# Altium schematic sheet [12] - FTDI.SchDoc: FTDI
size A3; Organization: Bjørn T. Brodtkorb; Address1: Frode Rinnans veg 161; Address2: 7050 Trondheim; DocumentNumber: 6598; Revision: 1.0; SheetNumber: 1; SheetTotal: 1
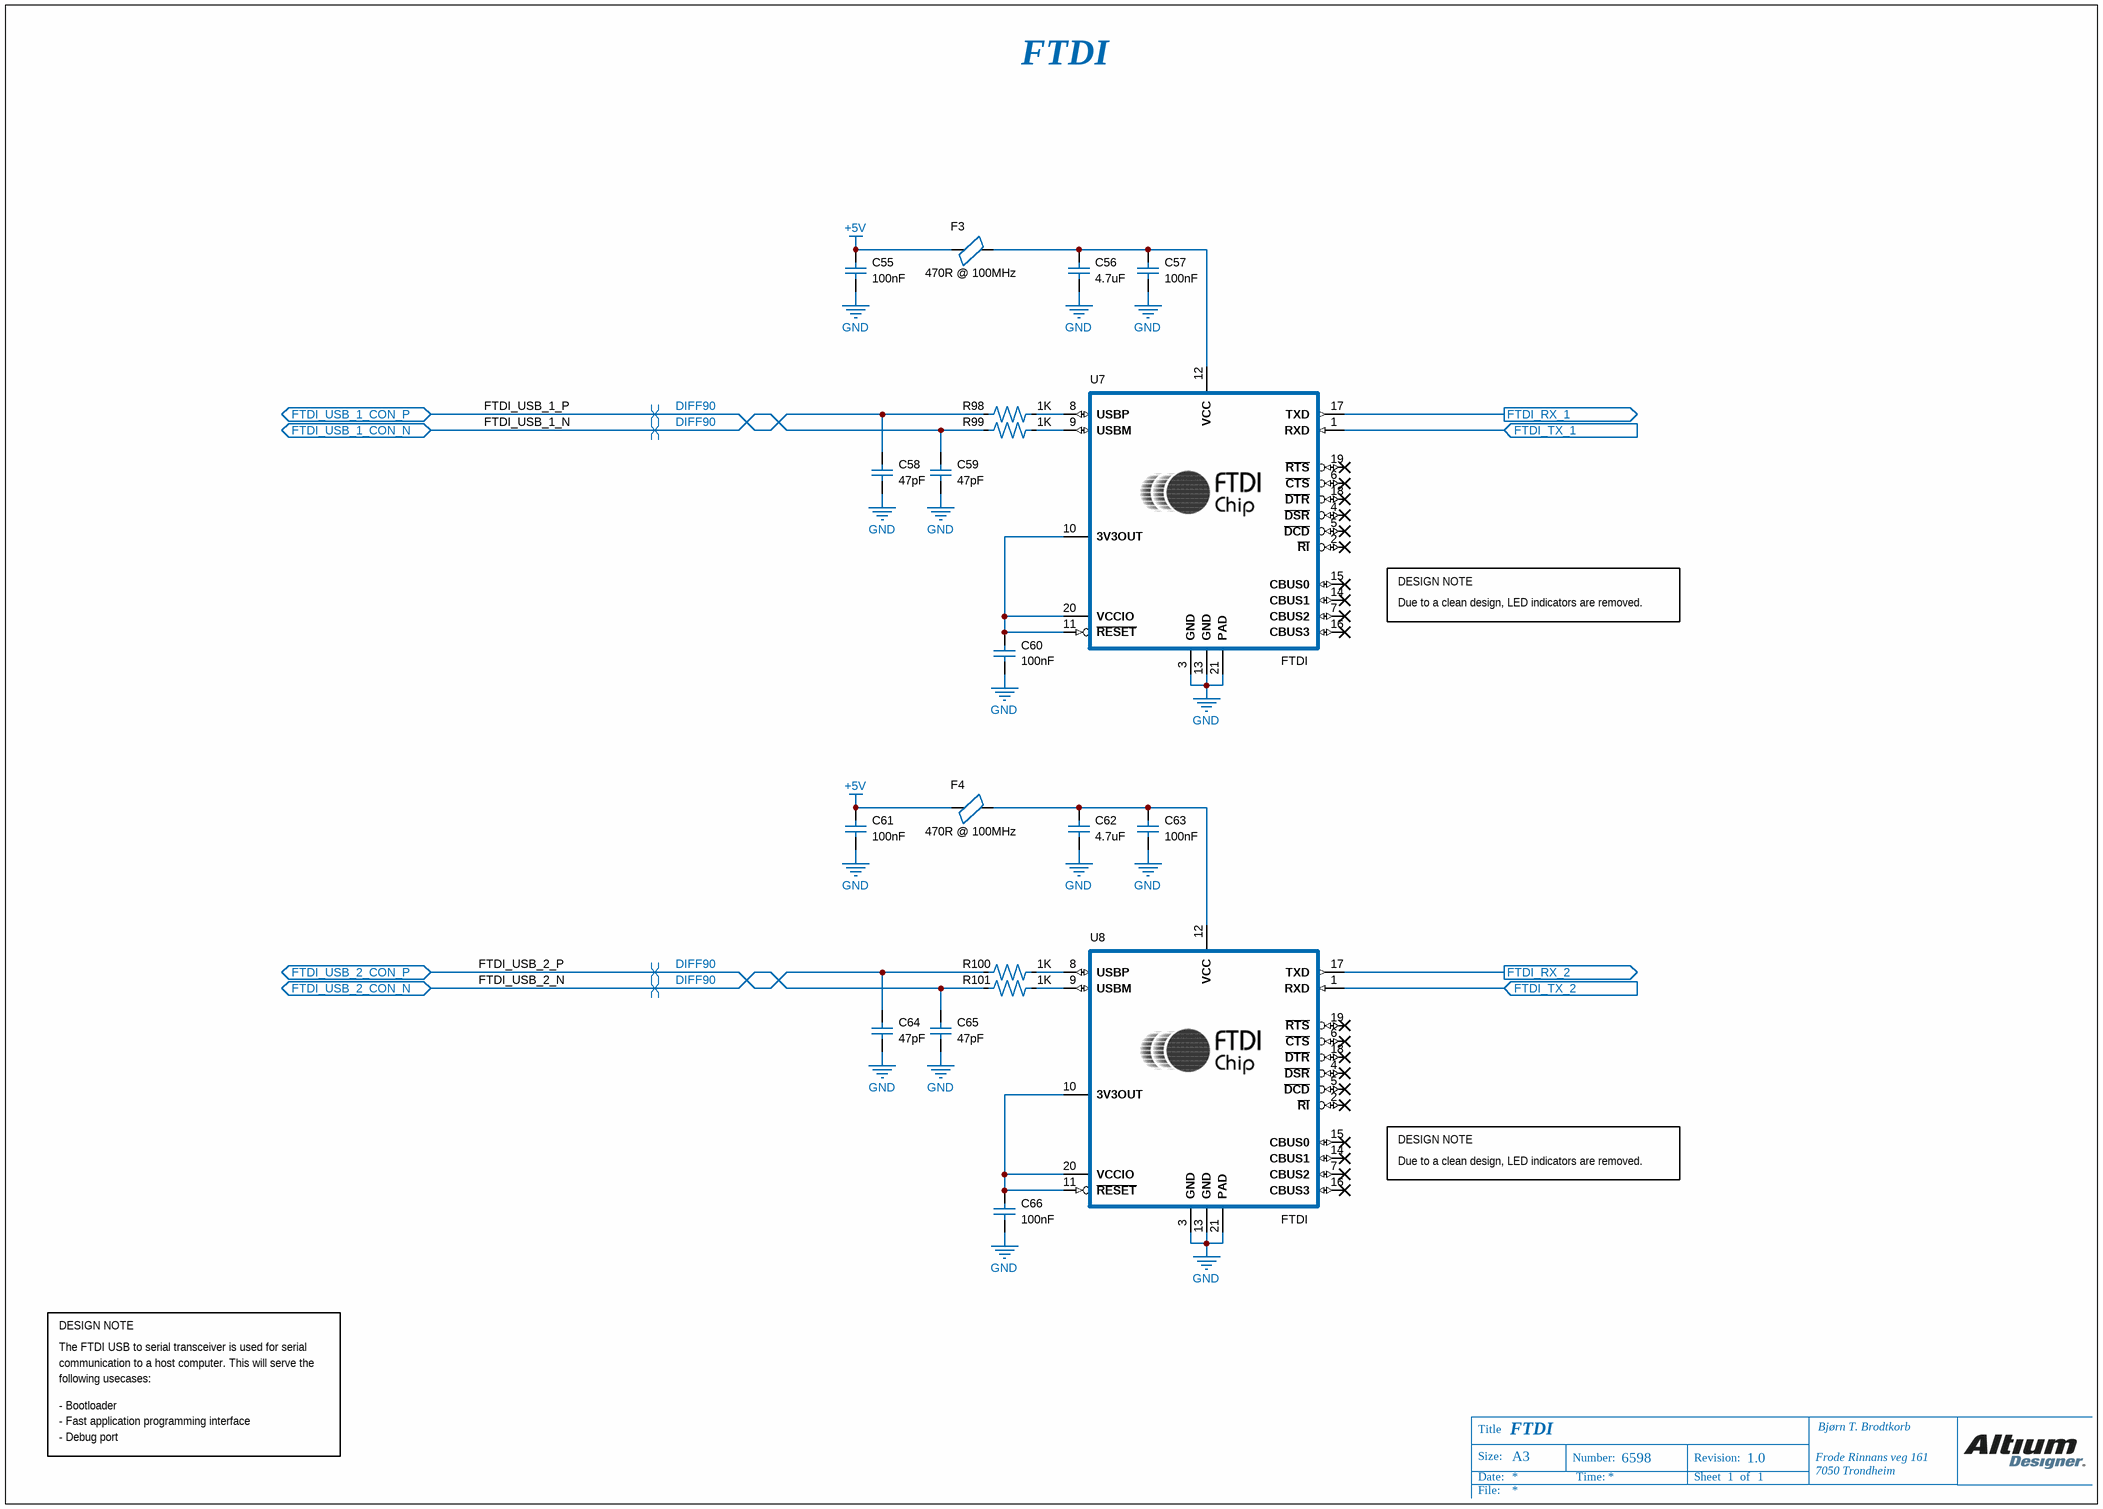
[diagram p0: [12] - FTDI.SchDoc]

## Parts
C55  value 100nF  [C0402]  (hidden comment: 04023C103KAT2A)
C56  value 4.7uF  [C0603]  (hidden comment: 02016D104KAT2A)
C57  value 100nF  [C0402]  (hidden comment: 04023C103KAT2A)
C58  value 47pF  [C0402]  (hidden comment: 04023C103KAT2A)
C59  value 47pF  [C0402]  (hidden comment: 04023C103KAT2A)
C60  value 100nF  [C0402]  (hidden comment: 04023C103KAT2A)
C61  value 100nF  [C0402]  (hidden comment: 04023C103KAT2A)
C62  value 4.7uF  [C0603]  (hidden comment: 02016D104KAT2A)
C63  value 100nF  [C0402]  (hidden comment: 04023C103KAT2A)
C64  value 47pF  [C0402]  (hidden comment: 04023C103KAT2A)
C65  value 47pF  [C0402]  (hidden comment: 04023C103KAT2A)
C66  value 100nF  [C0402]  (hidden comment: 04023C103KAT2A)
F3  value 470R @ 100MHz  [Ferrite bead 0402]  (hidden comment: BLM15AG102SN1D)
F4  value 470R @ 100MHz  [Ferrite bead 0402]  (hidden comment: BLM15AG102SN1D)
R98  value 1K  [R0402]  (hidden comment: CRCW04020000Z0ED)
R99  value 1K  [R0402]  (hidden comment: CRCW04020000Z0ED)
R100  value 1K  [R0402]  (hidden comment: CRCW04020000Z0ED)
R101  value 1K  [R0402]  (hidden comment: CRCW04020000Z0ED)
U7  FTDI  [FT231XQ-R]
U8  FTDI  [FT231XQ-R]

## Ports
FTDI_RX_1 (out), FTDI_RX_2 (out), FTDI_TX_1 (in), FTDI_TX_2 (in), FTDI_USB_1_CON_N (bidir), FTDI_USB_1_CON_P (bidir), FTDI_USB_2_CON_N (bidir), FTDI_USB_2_CON_P (bidir)

## Nets
+5V: C55.1 C61.1 F3.1 F4.1
GND: C55.2 C56.2 C57.2 C58.2 C59.2 C60.2 C61.2 C62.2 C63.2 C64.2 C65.2 C66.2 U7.3(GND) U7.13(GND) U7.21(PAD) U8.3(GND) U8.13(GND) U8.21(PAD)
FTDI_RX_1: U7.17(TXD) ; port FTDI_RX_1
FTDI_RX_2: U8.17(TXD) ; port FTDI_RX_2
FTDI_TX_1: U7.1(RXD) ; port FTDI_TX_1
FTDI_TX_2: U8.1(RXD) ; port FTDI_TX_2
FTDI_USB_1_N: C59.1 R99.1 ; port FTDI_USB_1_CON_N
FTDI_USB_1_P: C58.1 R98.1 ; port FTDI_USB_1_CON_P
FTDI_USB_2_N: C65.1 R101.1 ; port FTDI_USB_2_CON_N
FTDI_USB_2_P: C64.1 R100.1 ; port FTDI_USB_2_CON_P
NetC56_1: C56.1 C57.1 F3.2 U7.12(VCC)
NetC60_1: C60.1 U7.10(3V3OUT) U7.11(~{RESET}) U7.20(VCCIO)
NetC62_1: C62.1 C63.1 F4.2 U8.12(VCC)
NetC66_1: C66.1 U8.10(3V3OUT) U8.11(~{RESET}) U8.20(VCCIO)
NetR98_2: R98.2 U7.8(USBP)
NetR99_2: R99.2 U7.9(USBM)
NetR100_2: R100.2 U8.8(USBP)
NetR101_2: R101.2 U8.9(USBM)

Not connected (* = marked no-connect by the designer): U7 2(~{RI})* 4(~{DSR})* 5(~{DCD})* 6(~{CTS})* 7(CBUS2)* 14(CBUS1)* 15(CBUS0)* 16(CBUS3)* 18(~{DTR})* 19(~{RTS})*; U8 2(~{RI})* 4(~{DSR})* 5(~{DCD})* 6(~{CTS})* 7(CBUS2)* 14(CBUS1)* 15(CBUS0)* 16(CBUS3)* 18(~{DTR})* 19(~{RTS})*

## Layout directives
differential pair; differential pair class DIFF90: FTDI_USB_1_N, FTDI_USB_1_P, FTDI_USB_2_N, FTDI_USB_2_P

## Notes on the sheet
- FTDI
- DESIGN NOTE
- Due to a clean design, LED indicators are removed.
- The FTDI USB to serial transceiver is used for serial
- communication to a host computer. This will serve the
- following usecases:
- - Bootloader
- - Fast application programming interface
- - Debug port
- Title
- Size:
- A3
- Number:
- Revision:
- Date:
- File:
- Time:
- Sheet
- of

## Library data of the parts
C55 C57-C61 C63-C66 = 04023C103KAT2A: C0402
C56 C62 = 02016D104KAT2A: C0603
F3 F4 = BLM15AG102SN1D: Ferrite bead 0402
R98-R101 = CRCW04020000Z0ED: R0402
U7 U8 = FT231XQ-R: USB to RS-232 converter; Supplier Part Number 1: 2081330; Supplier 1: Farnell